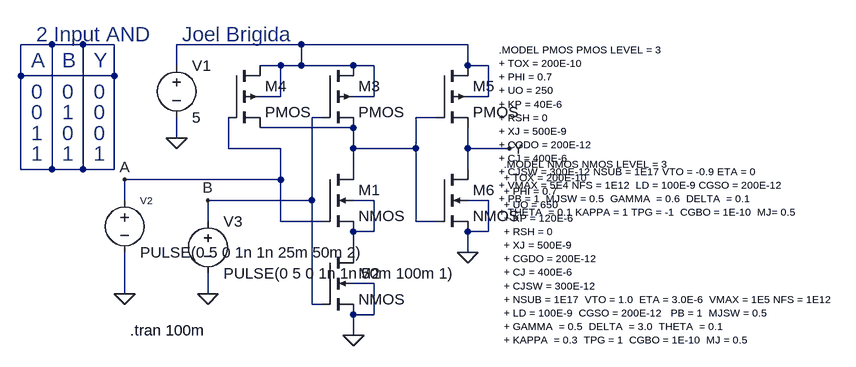
[diagram p0: schematic 2AND.asc]
2AND.asc, the LTspice schematic file:
Version 4
SHEET 1 880 680
WIRE -224 -16 -272 -16
WIRE -176 -16 -224 -16
WIRE -128 -16 -176 -16
WIRE 160 -16 -32 -16
WIRE 416 -16 160 -16
WIRE -32 16 -32 -16
WIRE 128 16 96 16
WIRE 160 16 160 -16
WIRE 160 16 128 16
WIRE 240 16 160 16
WIRE 272 16 240 16
WIRE 416 16 416 -16
WIRE 448 16 416 16
WIRE -272 32 -272 -16
WIRE -128 32 -128 -16
WIRE -128 32 -272 32
WIRE 128 64 128 16
WIRE 128 64 96 64
WIRE 272 64 272 16
WIRE 272 64 240 64
WIRE 448 64 448 16
WIRE 448 64 416 64
WIRE 192 96 176 96
WIRE 368 96 336 96
WIRE 240 112 96 112
WIRE -32 128 -32 96
WIRE 48 144 48 96
WIRE 128 144 48 144
WIRE 240 144 240 112
WIRE 336 144 336 96
WIRE 336 144 240 144
WIRE 416 144 416 112
WIRE 480 144 416 144
WIRE -272 176 -272 32
WIRE -224 176 -224 -16
WIRE -224 176 -272 176
WIRE -176 176 -176 -16
WIRE -176 176 -224 176
WIRE -128 176 -128 32
WIRE -128 176 -176 176
WIRE 240 176 240 144
WIRE 416 176 416 144
WIRE 128 192 128 144
WIRE 128 192 -112 192
WIRE -112 224 -112 192
WIRE 176 224 176 96
WIRE 176 224 16 224
WIRE 272 224 240 224
WIRE 448 224 416 224
WIRE 16 256 16 224
WIRE 128 256 128 192
WIRE 192 256 128 256
WIRE 336 256 336 144
WIRE 368 256 336 256
WIRE 272 272 272 224
WIRE 272 272 240 272
WIRE 448 272 448 224
WIRE 448 272 416 272
WIRE 240 304 240 272
WIRE 416 304 416 272
WIRE 272 352 240 352
WIRE -112 368 -112 304
WIRE 16 368 16 336
WIRE 176 384 176 224
WIRE 192 384 176 384
WIRE 272 400 272 352
WIRE 272 400 240 400
WIRE 240 432 240 400
FLAG 240 432 0
FLAG 416 304 0
FLAG -32 128 0
FLAG -112 368 0
FLAG 16 368 0
FLAG -112 192 A
FLAG 16 224 B
FLAG 480 144 Y
SYMBOL nmos4 192 176 R0
SYMATTR InstName M1
SYMBOL nmos4 192 304 R0
SYMATTR InstName M2
SYMBOL pmos4 192 16 R0
SYMATTR InstName M3
SYMBOL pmos4 48 16 R0
SYMATTR InstName M4
SYMBOL pmos4 368 16 R0
SYMATTR InstName M5
SYMBOL nmos4 368 176 R0
SYMATTR InstName M6
SYMBOL voltage -32 0 R0
WINDOW 123 0 0 Left 0
WINDOW 39 0 0 Left 0
SYMATTR InstName V1
SYMATTR Value 5
SYMBOL voltage -112 208 R0
WINDOW 0 24 16 Left 1
WINDOW 123 0 0 Left 0
WINDOW 39 0 0 Left 0
SYMATTR InstName V2
SYMATTR Value PULSE(0 5 0 1n 1n 25m 50m 2)
SYMBOL voltage 16 240 R0
WINDOW 123 0 0 Left 0
WINDOW 39 0 0 Left 0
SYMATTR InstName V3
SYMATTR Value PULSE(0 5 0 1n 1n 50m 100m 1)
TEXT 472 168 Left 1 !.MODEL NMOS NMOS LEVEL = 3\n+ TOX = 200E-10\n+ PHI = 0.7\n+ UO = 650\n+ KP = 120E-6\n+ RSH = 0\n+ XJ = 500E-9\n+ CGDO = 200E-12\n+ CJ = 400E-6\n+ CJSW = 300E-12\n+ NSUB = 1E17  VTO = 1.0  ETA = 3.0E-6  VMAX = 1E5 NFS = 1E12   \n+ LD = 100E-9  CGSO = 200E-12   PB = 1  MJSW = 0.5\n+ GAMMA  = 0.5  DELTA  = 3.0  THETA  = 0.1\n+ KAPPA  = 0.3  TPG = 1  CGBO = 1E-10  MJ = 0.5
TEXT 464 -8 Left 1 !.MODEL PMOS PMOS LEVEL = 3\n+ TOX = 200E-10\n+ PHI = 0.7\n+ UO = 250 \n+ KP = 40E-6\n+ RSH = 0\n+ XJ = 500E-9 \n+ CGDO = 200E-12 \n+ CJ = 400E-6\n+ CJSW = 300E-12 NSUB = 1E17 VTO = -0.9 ETA = 0\n+ VMAX = 5E4 NFS = 1E12  LD = 100E-9 CGSO = 200E-12\n+ PB = 1  MJSW = 0.5  GAMMA  = 0.6  DELTA  = 0.1\n+ THETA  = 0.1 KAPPA = 1 TPG = -1  CGBO = 1E-10  MJ= 0.5
TEXT -256 8 Left 3 ;A
TEXT -208 8 Left 3 ;B
TEXT -160 8 Left 3 ;Y
TEXT -256 56 Left 3 ;0
TEXT -160 56 Left 3 ;0
TEXT -160 88 Left 3 ;0
TEXT -160 120 Left 3 ;0
TEXT -256 88 Left 3 ;0
TEXT -160 152 Left 3 ;1
TEXT -208 120 Left 3 ;0
TEXT -208 56 Left 3 ;0
TEXT -208 88 Left 3 ;1
TEXT -256 120 Left 3 ;1
TEXT -256 152 Left 3 ;1
TEXT -208 152 Left 3 ;1
TEXT -24 -32 Left 3 ;Joel Brigida
TEXT -104 424 Left 2 !.tran 100m
TEXT -248 -32 Left 3 ;2 Input AND

The netlist it stands for:
* 2AND.asc
M1 N003 A N004 N004 NMOS
M2 N004 B 0 0 NMOS
M3 N002 B N003 N002 PMOS
M4 N002 A N003 N002 PMOS
M5 N002 N003 Y N002 PMOS
M6 Y N003 0 0 NMOS
V1 N002 0 5
V2 A 0 PULSE(0 5 0 1n 1n 25m 50m 2)
V3 B 0 PULSE(0 5 0 1n 1n 50m 100m 1)
.model NMOS NMOS
.model PMOS PMOS
.lib standard.mos
.MODEL NMOS NMOS LEVEL = 3
+ TOX = 200E-10
+ PHI = 0.7
+ UO = 650
+ KP = 120E-6
+ RSH = 0
+ XJ = 500E-9
+ CGDO = 200E-12
+ CJ = 400E-6
+ CJSW = 300E-12
+ NSUB = 1E17  VTO = 1.0  ETA = 3.0E-6  VMAX = 1E5 NFS = 1E12
+ LD = 100E-9  CGSO = 200E-12   PB = 1  MJSW = 0.5
+ GAMMA  = 0.5  DELTA  = 3.0  THETA  = 0.1
+ KAPPA  = 0.3  TPG = 1  CGBO = 1E-10  MJ = 0.5
.MODEL PMOS PMOS LEVEL = 3
+ TOX = 200E-10
+ PHI = 0.7
+ UO = 250
+ KP = 40E-6
+ RSH = 0
+ XJ = 500E-9
+ CGDO = 200E-12
+ CJ = 400E-6
+ CJSW = 300E-12 NSUB = 1E17 VTO = -0.9 ETA = 0
+ VMAX = 5E4 NFS = 1E12  LD = 100E-9 CGSO = 200E-12
+ PB = 1  MJSW = 0.5  GAMMA  = 0.6  DELTA  = 0.1
+ THETA  = 0.1 KAPPA = 1 TPG = -1  CGBO = 1E-10  MJ= 0.5
* A
* B
* Y
* 0
* 0
* 0
* 0
* 0
* 1
* 0
* 0
* 1
* 1
* 1
* 1
* Joel Brigida
.tran 100m
* 2 Input AND
.backanno
.end